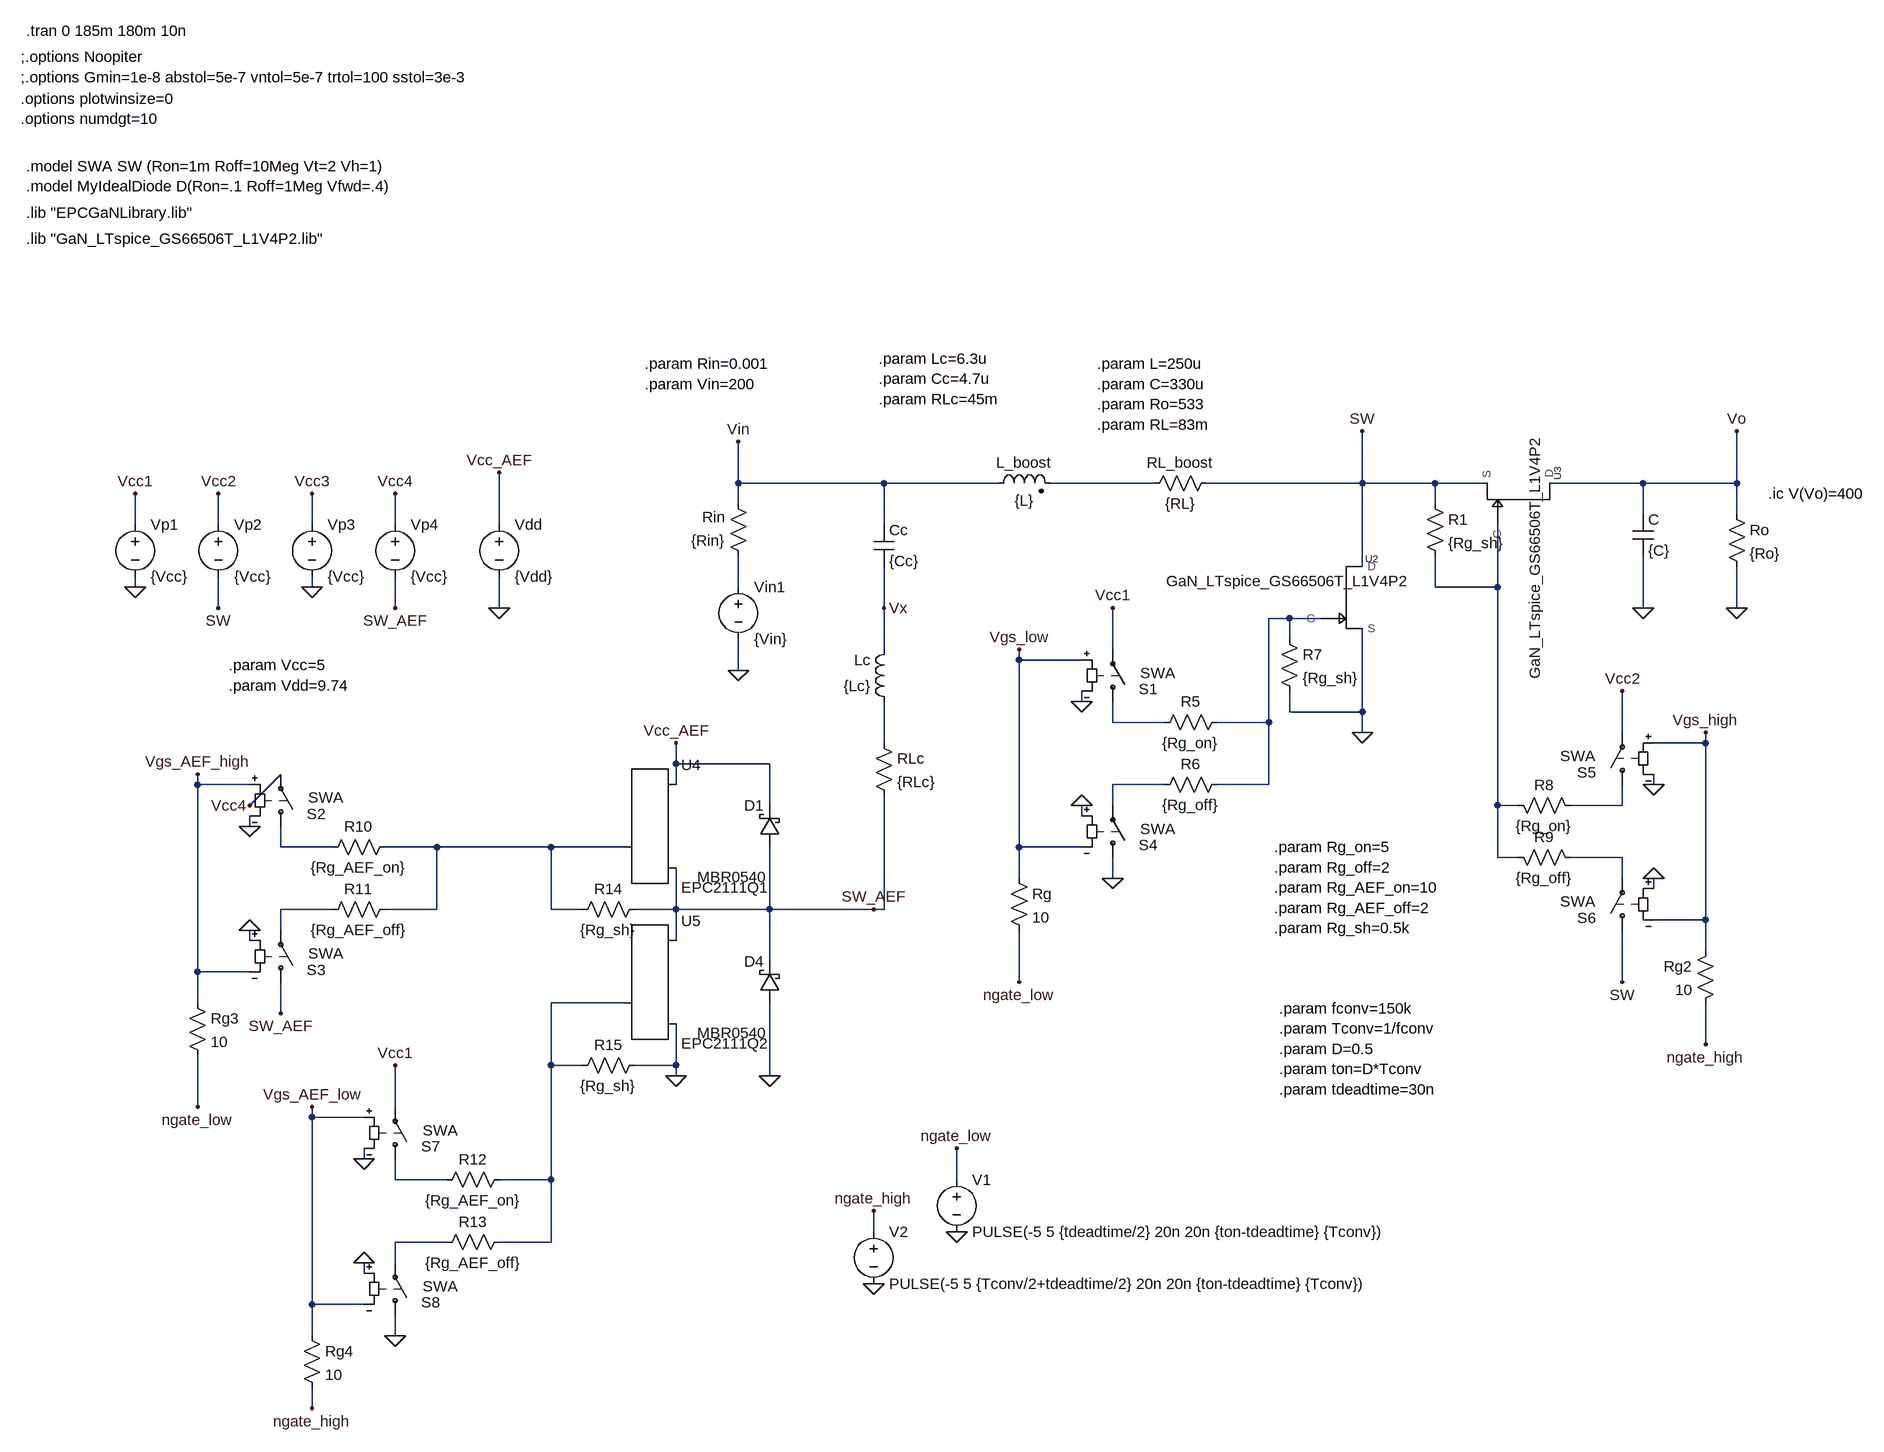
[diagram p0: schematic Boost converter with LC filter -20220120.asc]
Boost converter with LC filter -20220120.asc, the LTspice schematic file:
Version 4
SHEET 1 4440 3892
WIRE -960 640 -960 576
WIRE -736 640 -960 640
WIRE -560 640 -736 640
WIRE -320 640 -480 640
WIRE 0 640 0 560
WIRE 0 640 -240 640
WIRE 112 640 0 640
WIRE 192 640 112 640
WIRE 432 640 288 640
WIRE 576 640 576 560
WIRE 576 640 432 640
WIRE -960 672 -960 640
WIRE 112 672 112 640
WIRE 432 688 432 640
WIRE 576 688 576 640
WIRE -1888 704 -1888 656
WIRE -1760 704 -1760 656
WIRE -1616 704 -1616 656
WIRE -1488 704 -1488 656
WIRE -1328 704 -1328 624
WIRE -736 704 -736 640
WIRE 0 768 0 640
WIRE -1888 800 -1888 784
WIRE -1616 800 -1616 784
WIRE -960 800 -960 752
WIRE 112 800 112 752
WIRE 208 800 208 704
WIRE 208 800 112 800
WIRE -1760 832 -1760 784
WIRE -1488 832 -1488 784
WIRE -1328 832 -1328 784
WIRE -736 832 -736 768
WIRE 432 832 432 752
WIRE 576 832 576 768
WIRE -112 848 -144 848
WIRE -64 848 -112 848
WIRE -112 880 -112 848
WIRE -736 896 -736 832
WIRE -384 896 -384 832
WIRE -528 912 -528 896
WIRE -432 912 -528 912
WIRE -960 928 -960 880
WIRE -432 976 -432 960
WIRE -112 992 -112 960
WIRE 0 992 0 864
WIRE 0 992 -112 992
WIRE -384 1008 -384 976
WIRE -304 1008 -384 1008
WIRE -144 1008 -144 848
WIRE -144 1008 -224 1008
WIRE 0 1024 0 992
WIRE 400 1024 400 960
WIRE -736 1040 -736 976
WIRE 528 1040 528 1024
WIRE 528 1040 448 1040
WIRE -1056 1072 -1056 1040
WIRE -912 1072 -1056 1072
WIRE -1792 1104 -1792 1088
WIRE -1712 1104 -1792 1104
WIRE -1056 1104 -1056 1072
WIRE -304 1104 -384 1104
WIRE -144 1104 -144 1008
WIRE -144 1104 -224 1104
WIRE 448 1104 448 1088
WIRE -1712 1136 -1664 1088
WIRE -912 1136 -912 1072
WIRE -384 1136 -384 1104
WIRE 208 1136 208 800
WIRE 240 1136 208 1136
WIRE 400 1136 400 1104
WIRE 400 1136 320 1136
WIRE -432 1152 -432 1136
WIRE -1712 1168 -1712 1152
WIRE -1664 1200 -1664 1168
WIRE -1584 1200 -1664 1200
WIRE -1424 1200 -1504 1200
WIRE -1248 1200 -1424 1200
WIRE -1136 1200 -1248 1200
WIRE -528 1200 -528 912
WIRE -432 1200 -528 1200
WIRE 208 1216 208 1136
WIRE 240 1216 208 1216
WIRE 400 1216 320 1216
WIRE -528 1248 -528 1200
WIRE -384 1248 -384 1216
WIRE 400 1248 400 1216
WIRE 448 1264 448 1248
WIRE -1584 1296 -1664 1296
WIRE -1424 1296 -1424 1200
WIRE -1424 1296 -1504 1296
WIRE -1248 1296 -1248 1200
WIRE -1200 1296 -1248 1296
WIRE -1056 1296 -1056 1232
WIRE -1056 1296 -1120 1296
WIRE -912 1296 -912 1200
WIRE -912 1296 -1056 1296
WIRE -752 1296 -912 1296
WIRE -736 1296 -736 1120
WIRE -736 1296 -752 1296
WIRE 528 1312 528 1040
WIRE 528 1312 448 1312
WIRE -1664 1328 -1664 1296
WIRE -1712 1344 -1712 1328
WIRE -1056 1344 -1056 1296
WIRE 528 1360 528 1312
WIRE -912 1376 -912 1296
WIRE -1792 1392 -1792 1104
WIRE -1712 1392 -1792 1392
WIRE -528 1408 -528 1328
WIRE 400 1408 400 1328
WIRE -1792 1440 -1792 1392
WIRE -1136 1440 -1248 1440
WIRE -1664 1456 -1664 1408
WIRE 528 1504 528 1440
WIRE -1248 1536 -1248 1440
WIRE -1200 1536 -1248 1536
WIRE -1056 1536 -1056 1472
WIRE -1056 1536 -1120 1536
WIRE -1056 1552 -1056 1536
WIRE -912 1552 -912 1440
WIRE -1792 1600 -1792 1520
WIRE -1488 1600 -1488 1536
WIRE -1616 1616 -1616 1600
WIRE -1536 1616 -1616 1616
WIRE -1536 1680 -1536 1664
WIRE -1488 1712 -1488 1680
WIRE -1408 1712 -1488 1712
WIRE -1248 1712 -1248 1536
WIRE -1248 1712 -1328 1712
WIRE -624 1712 -624 1664
WIRE -752 1792 -752 1760
WIRE -1408 1808 -1488 1808
WIRE -1248 1808 -1248 1712
WIRE -1248 1808 -1328 1808
WIRE -1488 1840 -1488 1808
WIRE -1536 1856 -1536 1840
WIRE -1616 1904 -1616 1616
WIRE -1536 1904 -1616 1904
WIRE -1616 1952 -1616 1904
WIRE -1488 1952 -1488 1920
WIRE -1616 2064 -1616 2032
FLAG -960 928 0
FLAG -432 976 0
FLAG 432 832 0
FLAG 576 832 0
FLAG -960 576 Vin
FLAG -528 896 Vgs_low
FLAG 576 560 Vo
FLAG -1056 1040 Vcc_AEF
FLAG -1328 832 0
FLAG -1328 624 Vcc_AEF
FLAG -736 832 Vx
FLAG -1888 800 0
FLAG -528 1408 ngate_low
FLAG 0 1024 0
FLAG 0 560 SW
FLAG -1888 656 Vcc1
FLAG -1760 656 Vcc2
FLAG -1616 800 0
FLAG -1616 656 Vcc3
FLAG -1488 656 Vcc4
FLAG -384 832 Vcc1
FLAG -432 1136 0
FLAG -384 1248 0
FLAG 448 1104 0
FLAG 528 1024 Vgs_high
FLAG 528 1504 ngate_high
FLAG 400 960 Vcc2
FLAG 448 1248 0
FLAG 400 1408 SW
FLAG -1760 832 SW
FLAG -1056 1552 0
FLAG -912 1552 0
FLAG -1712 1168 0
FLAG -1792 1088 Vgs_AEF_high
FLAG -1792 1600 ngate_low
FLAG -1712 1136 Vcc4
FLAG -1712 1328 0
FLAG -752 1296 SW_AEF
FLAG -1536 1680 0
FLAG -1616 1600 Vgs_AEF_low
FLAG -1616 2064 ngate_high
FLAG -1488 1536 Vcc1
FLAG -1536 1840 0
FLAG -1488 1952 0
FLAG -1488 832 SW_AEF
FLAG -1664 1456 SW_AEF
FLAG -624 1792 0
FLAG -752 1872 0
FLAG -752 1760 ngate_high
FLAG -624 1664 ngate_low
SYMBOL voltage -960 784 R0
WINDOW 123 0 0 Left 2
WINDOW 39 0 0 Left 2
SYMATTR InstName Vin1
SYMATTR Value {Vin}
SYMBOL ind2 -576 656 R270
WINDOW 0 32 56 VTop 2
WINDOW 3 5 56 VBottom 2
SYMATTR InstName L_boost
SYMATTR Value {L}
SYMATTR Type ind
SYMBOL res -944 768 R180
WINDOW 0 36 76 Left 2
WINDOW 3 36 40 Left 2
SYMATTR InstName Rin
SYMATTR Value {Rin}
SYMBOL sw -384 992 M180
WINDOW 0 40 35 Left 2
WINDOW 3 42 60 Left 2
SYMATTR InstName S1
SYMATTR Value SWA
SYMBOL cap 416 688 R0
SYMATTR InstName C
SYMATTR Value {C}
SYMBOL res 560 672 R0
SYMATTR InstName Ro
SYMATTR Value {Ro}
SYMBOL res -544 1232 R0
SYMATTR InstName Rg
SYMATTR Value 10
SYMBOL ind -720 992 R180
WINDOW 0 36 80 Left 2
WINDOW 3 36 40 Left 2
SYMATTR InstName Lc
SYMATTR Value {Lc}
SYMBOL cap -752 704 R0
SYMATTR InstName Cc
SYMATTR Value {Cc}
SYMBOL voltage -1328 688 R0
WINDOW 123 0 0 Left 2
WINDOW 39 0 0 Left 2
SYMATTR InstName Vdd
SYMATTR Value {Vdd}
SYMBOL voltage -1888 688 R0
WINDOW 123 0 0 Left 2
WINDOW 39 0 0 Left 2
SYMATTR InstName Vp1
SYMATTR Value {Vcc}
SYMBOL GaN_LTspice_GS66506T_L1V4P2 -48 816 R0
SYMATTR InstName U2
SYMBOL GaN_LTspice_GS66506T_L1V4P2 240 688 M270
SYMATTR InstName U3
SYMBOL EPCGaN -1136 1200 R0
SYMATTR InstName U4
SYMATTR Value EPC2111Q1
SYMBOL EPCGaN -1136 1440 R0
SYMATTR InstName U5
SYMATTR Value EPC2111Q2
SYMBOL voltage -1760 688 R0
WINDOW 123 0 0 Left 2
WINDOW 39 0 0 Left 2
SYMATTR InstName Vp2
SYMATTR Value {Vcc}
SYMBOL voltage -1616 688 R0
WINDOW 123 0 0 Left 2
WINDOW 39 0 0 Left 2
SYMATTR InstName Vp3
SYMATTR Value {Vcc}
SYMBOL voltage -1488 688 R0
WINDOW 123 0 0 Left 2
WINDOW 39 0 0 Left 2
SYMATTR InstName Vp4
SYMATTR Value {Vcc}
SYMBOL res -208 992 R90
WINDOW 0 0 56 VBottom 2
WINDOW 3 32 56 VTop 2
SYMATTR InstName R5
SYMATTR Value {Rg_on}
SYMBOL sw -384 1232 M180
WINDOW 0 40 35 Left 2
WINDOW 3 42 60 Left 2
SYMATTR InstName S4
SYMATTR Value SWA
SYMBOL res -208 1088 R90
WINDOW 0 0 56 VBottom 2
WINDOW 3 32 56 VTop 2
SYMATTR InstName R6
SYMATTR Value {Rg_off}
SYMBOL res -128 864 R0
SYMATTR InstName R7
SYMATTR Value {Rg_sh}
SYMBOL sw 400 1120 R180
WINDOW 0 40 35 Left 2
WINDOW 3 42 60 Left 2
SYMATTR InstName S5
SYMATTR Value SWA
SYMBOL res 544 1344 M0
SYMATTR InstName Rg2
SYMATTR Value 10
SYMBOL res 224 1120 M90
WINDOW 0 0 56 VBottom 2
WINDOW 3 32 56 VTop 2
SYMATTR InstName R8
SYMATTR Value {Rg_on}
SYMBOL sw 400 1344 R180
WINDOW 0 40 35 Left 2
WINDOW 3 42 60 Left 2
SYMATTR InstName S6
SYMATTR Value SWA
SYMBOL res 224 1200 M90
WINDOW 0 0 56 VBottom 2
WINDOW 3 32 56 VTop 2
SYMATTR InstName R9
SYMATTR Value {Rg_off}
SYMBOL schottky -896 1200 R180
WINDOW 0 24 64 Left 2
WINDOW 3 20 -46 Left 2
SYMATTR InstName D1
SYMATTR Value MBR0540
SYMATTR Description Diode
SYMATTR Type diode
SYMBOL schottky -896 1440 R180
WINDOW 0 24 64 Left 2
WINDOW 3 20 -46 Left 2
SYMATTR InstName D4
SYMATTR Value MBR0540
SYMATTR Description Diode
SYMATTR Type diode
SYMBOL sw -1664 1184 M180
WINDOW 0 40 35 Left 2
WINDOW 3 42 60 Left 2
SYMATTR InstName S2
SYMATTR Value SWA
SYMBOL res -1808 1424 R0
SYMATTR InstName Rg3
SYMATTR Value 10
SYMBOL res -1488 1184 R90
WINDOW 0 0 56 VBottom 2
WINDOW 3 32 56 VTop 2
SYMATTR InstName R10
SYMATTR Value {Rg_AEF_on}
SYMBOL sw -1664 1424 M180
WINDOW 0 40 35 Left 2
WINDOW 3 42 60 Left 2
SYMATTR InstName S3
SYMATTR Value SWA
SYMBOL res -1488 1280 R90
WINDOW 0 0 56 VBottom 2
WINDOW 3 32 56 VTop 2
SYMATTR InstName R11
SYMATTR Value {Rg_AEF_off}
SYMBOL sw -1488 1696 M180
WINDOW 0 40 35 Left 2
WINDOW 3 42 60 Left 2
SYMATTR InstName S7
SYMATTR Value SWA
SYMBOL res -1632 1936 R0
SYMATTR InstName Rg4
SYMATTR Value 10
SYMBOL res -1312 1696 R90
WINDOW 0 0 56 VBottom 2
WINDOW 3 32 56 VTop 2
SYMATTR InstName R12
SYMATTR Value {Rg_AEF_on}
SYMBOL sw -1488 1936 M180
WINDOW 0 40 35 Left 2
WINDOW 3 42 60 Left 2
SYMATTR InstName S8
SYMATTR Value SWA
SYMBOL res -1312 1792 R90
WINDOW 0 0 56 VBottom 2
WINDOW 3 32 56 VTop 2
SYMATTR InstName R13
SYMATTR Value {Rg_AEF_off}
SYMBOL res -1104 1280 R90
WINDOW 0 0 56 VBottom 2
WINDOW 3 32 56 VTop 2
SYMATTR InstName R14
SYMATTR Value {Rg_sh}
SYMBOL res -1104 1520 R90
WINDOW 0 0 56 VBottom 2
WINDOW 3 32 56 VTop 2
SYMATTR InstName R15
SYMATTR Value {Rg_sh}
SYMBOL voltage -624 1696 R0
WINDOW 123 0 0 Left 2
WINDOW 39 0 0 Left 2
SYMATTR InstName V1
SYMATTR Value PULSE(-5 5 {tdeadtime/2} 20n 20n {ton-tdeadtime} {Tconv})
SYMBOL voltage -752 1776 R0
WINDOW 123 0 0 Left 2
WINDOW 39 0 0 Left 2
SYMATTR InstName V2
SYMATTR Value PULSE(-5 5 {Tconv/2+tdeadtime/2} 20n 20n {ton-tdeadtime} {Tconv})
SYMBOL res 96 656 R0
SYMATTR InstName R1
SYMATTR Value {Rg_sh}
SYMBOL res -752 1024 R0
SYMATTR InstName RLc
SYMATTR Value {RLc}
SYMBOL res -224 624 R90
WINDOW 0 0 56 VBottom 2
WINDOW 3 32 56 VTop 2
SYMATTR InstName RL_boost
SYMATTR Value {RL}
TEXT -128 1448 Left 2 !.param fconv=150k \n.param Tconv=1/fconv\n.param D=0.5\n.param ton=D*Tconv\n.param tdeadtime=30n
TEXT -2064 -16 Left 2 !;.options Noopiter\n;.options Gmin=1e-8 abstol=5e-7 vntol=5e-7 trtol=100 sstol=3e-3
TEXT -2056 -56 Left 2 !.tran 0 185m 180m 10n
TEXT -2064 48 Left 2 !.options plotwinsize=0\n.options numdgt=10
TEXT -2056 152 Left 2 !.model SWA SW (Ron=1m Roff=10Meg Vt=2 Vh=1)\n.model MyIdealDiode D(Ron=.1 Roff=1Meg Vfwd=.4)
TEXT -1104 456 Left 2 !.param Rin=0.001\n.param Vin=200
TEXT -408 456 Left 2 !.param L=250u\n.param C=330u\n.param Ro=533\n.param RL=83m
TEXT 624 656 Left 2 !.ic V(Vo)=400
TEXT -2056 224 Left 2 !.lib "EPCGaNLibrary.lib"
TEXT -2056 264 Left 2 !.lib "GaN_LTspice_GS66506T_L1V4P2.lib"
TEXT -1744 920 Left 2 !.param Vcc=5\n.param Vdd=9.74
TEXT -136 1200 Left 2 !.param Rg_on=5\n.param Rg_off=2\n.param Rg_AEF_on=10\n.param Rg_AEF_off=2\n.param Rg_sh=0.5k
TEXT -744 448 Left 2 !.param Lc=6.3u\n.param Cc=4.7u\n.param RLc=45m

The netlist it stands for:
* Boost converter with LC filter -20220120.asc
Vin1 N002 0 {Vin}
L_boost Vin N001 {L}
Rin N002 Vin {Rin}
S1 N005 Vcc1 Vgs_low 0 SWA
C Vo 0 {C}
Ro Vo 0 {Ro}
Rg Vgs_low ngate_low 10
Lc N006 Vx {Lc}
Cc Vin Vx {Cc}
Vdd Vcc_AEF 0 {Vdd}
Vp1 Vcc1 0 {Vcc}
XU2 N004 SW 0 GaN_LTspice_GS66506T_L1V4P2  ; pins G D S
XU3 N003 Vo SW GaN_LTspice_GS66506T_L1V4P2  ; pins G D S
XU4 N010 Vcc_AEF SW_AEF EPC2111Q1
XU5 N013 SW_AEF 0 EPC2111Q2
Vp2 Vcc2 SW {Vcc}
Vp3 Vcc3 0 {Vcc}
Vp4 Vcc4 SW_AEF {Vcc}
R5 N004 N005 {Rg_on}
S4 0 N007 0 Vgs_low SWA
R6 N004 N007 {Rg_off}
R7 N004 0 {Rg_sh}
S5 N008 Vcc2 Vgs_high 0 SWA
Rg2 Vgs_high ngate_high 10
R8 N003 N008 {Rg_on}
S6 SW N011 0 Vgs_high SWA
R9 N003 N011 {Rg_off}
D1 SW_AEF Vcc_AEF MBR0540
D4 0 SW_AEF MBR0540
S2 N009 Vcc4 Vgs_AEF_high 0 SWA
Rg3 Vgs_AEF_high ngate_low 10
R10 N010 N009 {Rg_AEF_on}
S3 SW_AEF N012 0 Vgs_AEF_high SWA
R11 N010 N012 {Rg_AEF_off}
S7 N014 Vcc1 Vgs_AEF_low 0 SWA
Rg4 Vgs_AEF_low ngate_high 10
R12 N013 N014 {Rg_AEF_on}
S8 0 N015 0 Vgs_AEF_low SWA
R13 N013 N015 {Rg_AEF_off}
R14 SW_AEF N010 {Rg_sh}
R15 0 N013 {Rg_sh}
V1 ngate_low 0 PULSE(-5 5 {tdeadtime/2} 20n 20n {ton-tdeadtime} {Tconv})
V2 ngate_high 0 PULSE(-5 5 {Tconv/2+tdeadtime/2} 20n 20n {ton-tdeadtime} {Tconv})
R1 SW N003 {Rg_sh}
RLc N006 SW_AEF {RLc}
RL_boost SW N001 {RL}
.model D D
.lib standard.dio
.param fconv=150k
.param Tconv=1/fconv
.param D=0.5
.param ton=D*Tconv
.param tdeadtime=30n
;.options Noopiter
;.options Gmin=1e-8 abstol=5e-7 vntol=5e-7 trtol=100 sstol=3e-3
.tran 0 185m 180m 10n
.options plotwinsize=0
.options numdgt=10
.model SWA SW (Ron=1m Roff=10Meg Vt=2 Vh=1)
.model MyIdealDiode D(Ron=.1 Roff=1Meg Vfwd=.4)
.param Rin=0.001
.param Vin=200
.param L=250u
.param C=330u
.param Ro=533
.param RL=83m
.ic V(Vo)=400
.lib "EPCGaNLibrary.lib"
.lib "GaN_LTspice_GS66506T_L1V4P2.lib"
.param Vcc=5
.param Vdd=9.74
.param Rg_on=5
.param Rg_off=2
.param Rg_AEF_on=10
.param Rg_AEF_off=2
.param Rg_sh=0.5k
.param Lc=6.3u
.param Cc=4.7u
.param RLc=45m
.lib GaN_LTspice_GS66506T_L1V4P2.lib
.backanno
.end